# Altium schematic sheet filtroFinal.SchDoc
size A4
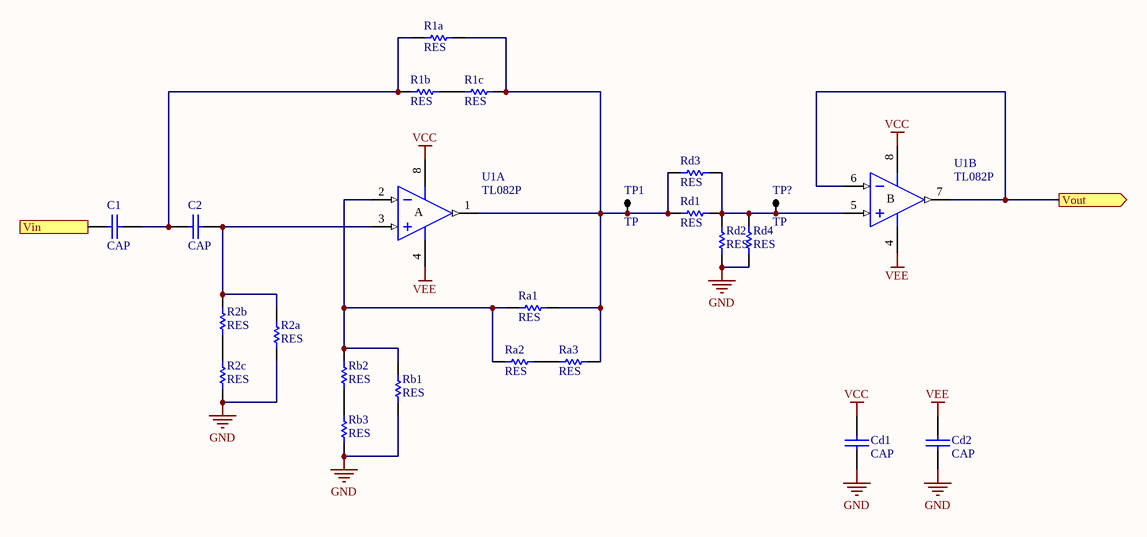
[diagram p0: filtroFinal.SchDoc]

## Parts
C1  CAP  [CAP200]
C2  CAP  [CAP200]
Cd1  CAP  [CAP200]
Cd2  CAP  [CAP200]
R1a  RES  [0805]
R1b  RES  [0805]
R1c  RES  [0805]
R2a  RES  [0805]
R2b  RES  [0805]
R2c  RES  [0805]
Ra1  RES  [0805]
Ra2  RES  [0805]
Ra3  RES  [0805]
Rb1  RES  [0805]
Rb2  RES  [0805]
Rb3  RES  [0805]
Rd1  RES  [0805]
Rd2  RES  [0805]
Rd3  RES  [0805]
Rd4  RES  [0805]
TP1  TP  [TPTH]
TP?  TP  [TPTH]
U1  TL082P  [P008]  (parts A,B of 2)

## Ports
Vin (in), Vout (out)

## Nets
GND: Cd1.2 Cd2.2 R2a.1 R2c.1 Rb1.1 Rb3.1 Rd2.1 Rd4.1
VCC: Cd1.1 U1.8(V+)
VEE: Cd2.1 U1.4(V-)
Vin: C1.1 ; port Vin
Vout: U1.6(IN-) U1.7(OUT) ; port Vout
NetC1_2: C1.2 C2.1 R1a.2 R1b.2
NetC2_2: C2.2 R2a.2 R2b.2 U1.3(IN+)
NetR1a_1: R1a.1 R1c.1 Ra1.1 Ra3.1 Rd1.1 Rd3.1 TP1.1 U1.1(OUT)
NetR1b_1: R1b.1 R1c.2
NetR2b_1: R2b.1 R2c.2
NetRa1_2: Ra1.2 Ra2.2 Rb1.2 Rb2.2 U1.2(IN-)
NetRa2_1: Ra2.1 Ra3.2
NetRb2_1: Rb2.1 Rb3.2
NetRd1_2: Rd1.2 Rd2.2 Rd3.2 Rd4.2 TP?.1 U1.5(IN+)

## Notes on the sheet
- (in symbol TL082P, part A) A
- (in symbol TL082P, part B) B

## Library data of the parts
U1 = TL082P: JFET-Input Operational Amplifier; Published: 16-Jan-2001; LatestRevisionDate: 04-Mar-2005; LatestRevisionNote: Stylized 3D Model Added.; DatasheetVersion: Feb-1999; PackageVersion: Jun-1999; PackageReference: P008; Publisher: Altium Limited; PackageDescription: DIP; 8 Leads; Row Spacing 7.62 mm; Pitch 2.54 mm; Code_JEDEC: MO-001-AN; ComponentLink1Description: Manufacturer Link; ComponentLink1URL: http://www.ti.com/; ComponentLink2Description: Datasheet; ComponentLink2URL: http://www-s.ti.com/sc/ds/tl082.pdf